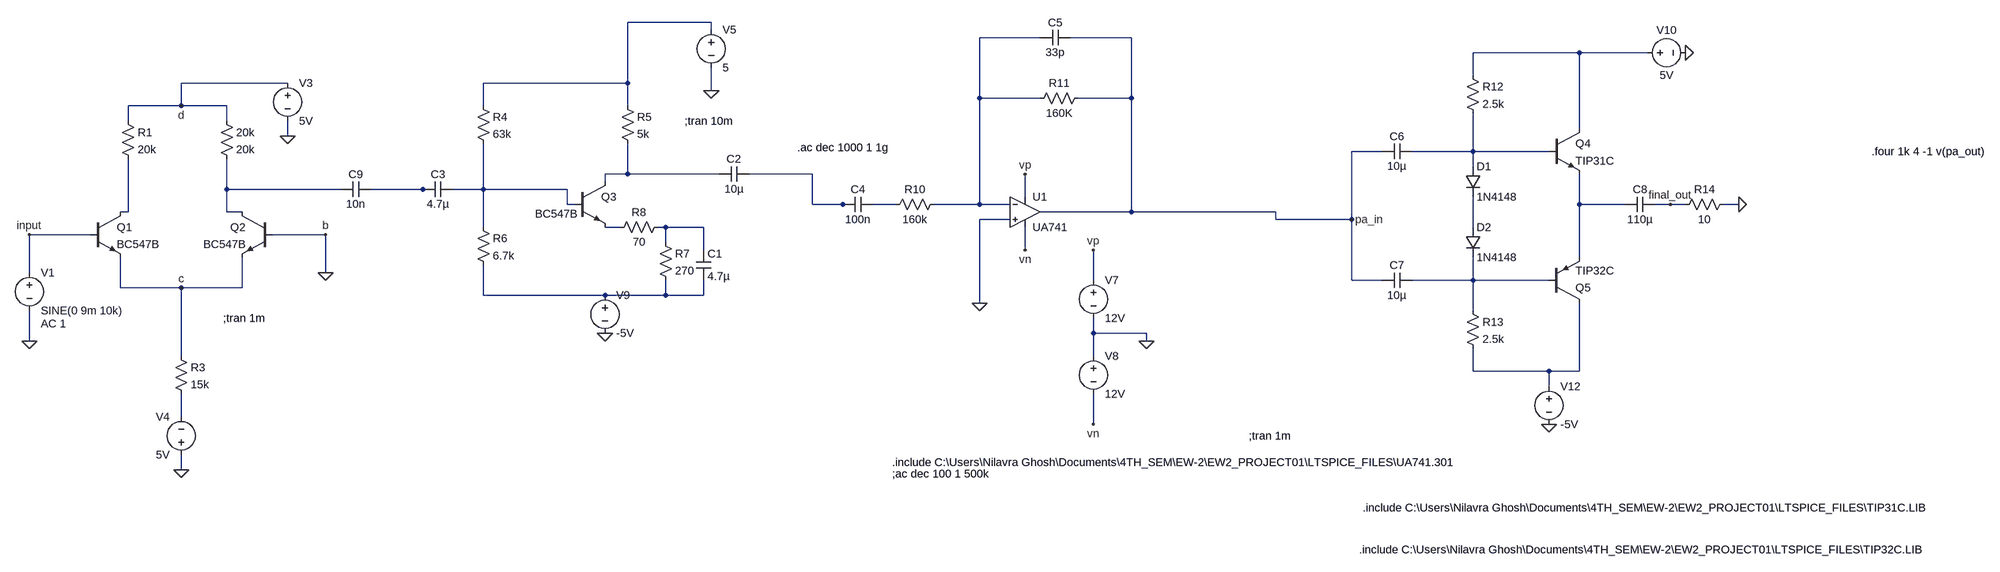
[diagram p0: schematic all_combined.asc]
all_combined.asc, the LTspice schematic file:
Version 4
SHEET 1 3748 680
WIRE 992 -624 816 -624
WIRE 992 -608 992 -624
WIRE 1712 -592 1584 -592
WIRE 1904 -592 1776 -592
WIRE 2848 -560 2624 -560
WIRE 2992 -560 2848 -560
WIRE 2624 -512 2624 -560
WIRE -16 -496 -240 -496
WIRE 816 -496 816 -624
WIRE 816 -496 512 -496
WIRE 992 -480 992 -528
WIRE 1584 -464 1584 -592
WIRE 1712 -464 1584 -464
WIRE 1904 -464 1904 -592
WIRE 1904 -464 1792 -464
WIRE -240 -448 -240 -496
WIRE -240 -448 -352 -448
WIRE -144 -448 -240 -448
WIRE 512 -448 512 -496
WIRE 816 -448 816 -496
WIRE -352 -416 -352 -448
WIRE -144 -416 -144 -448
WIRE 2848 -400 2848 -560
WIRE -16 -384 -16 -416
WIRE 2432 -352 2368 -352
WIRE 2624 -352 2624 -432
WIRE 2624 -352 2496 -352
WIRE 2784 -352 2624 -352
WIRE 2624 -320 2624 -352
WIRE 816 -304 816 -368
WIRE 816 -304 768 -304
WIRE 1008 -304 816 -304
WIRE 1232 -304 1072 -304
WIRE 768 -288 768 -304
WIRE -144 -272 -144 -336
WIRE 96 -272 -144 -272
WIRE 384 -272 160 -272
WIRE 400 -272 384 -272
WIRE 512 -272 512 -368
WIRE 512 -272 448 -272
WIRE 688 -272 512 -272
WIRE 1680 -256 1680 -304
WIRE 688 -240 688 -272
WIRE 704 -240 688 -240
WIRE 1232 -240 1232 -304
WIRE 1296 -240 1232 -240
WIRE 1312 -240 1296 -240
WIRE 1408 -240 1360 -240
WIRE 1584 -240 1584 -464
WIRE 1584 -240 1488 -240
WIRE 1648 -240 1584 -240
WIRE 2848 -240 2848 -304
WIRE 2944 -240 2848 -240
WIRE 3040 -240 3008 -240
WIRE 3072 -240 3040 -240
WIRE 3184 -240 3152 -240
WIRE -352 -224 -352 -336
WIRE -352 -224 -368 -224
WIRE -144 -224 -144 -272
WIRE -112 -224 -144 -224
WIRE 1904 -224 1904 -464
WIRE 1904 -224 1712 -224
WIRE 2208 -224 1904 -224
WIRE 1648 -208 1584 -208
WIRE 2208 -208 2208 -224
WIRE 2368 -208 2368 -352
WIRE 2368 -208 2208 -208
WIRE 512 -192 512 -272
WIRE 800 -192 768 -192
WIRE 896 -192 880 -192
WIRE 976 -192 896 -192
WIRE 2624 -192 2624 -256
WIRE -432 -176 -560 -176
WIRE 64 -176 -48 -176
WIRE 896 -160 896 -192
WIRE 976 -144 976 -192
WIRE 1680 -144 1680 -192
WIRE 2848 -128 2848 -240
WIRE -560 -96 -560 -176
WIRE 64 -96 64 -176
WIRE 1824 -80 1824 -144
WIRE 2368 -80 2368 -208
WIRE 2432 -80 2368 -80
WIRE 2624 -80 2624 -128
WIRE 2624 -80 2496 -80
WIRE 2784 -80 2624 -80
WIRE -368 -64 -368 -128
WIRE -240 -64 -368 -64
WIRE -112 -64 -112 -128
WIRE -112 -64 -240 -64
WIRE 512 -48 512 -112
WIRE 768 -48 512 -48
WIRE 896 -48 896 -80
WIRE 896 -48 768 -48
WIRE 976 -48 976 -80
WIRE 976 -48 896 -48
WIRE 1584 -32 1584 -208
WIRE 2624 -16 2624 -80
WIRE 1824 32 1824 0
WIRE 1936 32 1824 32
WIRE -560 48 -560 -16
WIRE 1936 48 1936 32
WIRE -240 80 -240 -64
WIRE 1824 80 1824 32
WIRE 2624 112 2624 64
WIRE 2784 112 2624 112
WIRE 2848 112 2848 -32
WIRE 2848 112 2784 112
WIRE 2784 144 2784 112
WIRE -240 208 -240 160
WIRE 1824 224 1824 160
WIRE -240 320 -240 288
FLAG -560 48 0
FLAG -16 -384 0
FLAG -240 320 0
FLAG -560 -176 input
FLAG 64 -176 b
FLAG -240 -64 c
FLAG -240 -448 d
FLAG 1936 48 0
FLAG 1824 -144 vp
FLAG 1824 224 vn
FLAG 1680 -304 vp
FLAG 1680 -144 vn
FLAG 1584 -32 0
FLAG 3184 -240 0
FLAG 3072 -560 0
FLAG 2784 224 0
FLAG 2368 -208 pa_in
FLAG 3040 -240 final_out
FLAG 992 -480 0
FLAG 768 32 0
FLAG 64 -96 0
SYMBOL voltage -560 -112 R0
WINDOW 123 24 124 Left 2
WINDOW 39 0 0 Left 0
SYMATTR Value2 AC 1
SYMATTR InstName V1
SYMATTR Value SINE(0 9m 10k)
SYMBOL res -368 -432 R0
SYMATTR InstName R1
SYMATTR Value 20k
SYMBOL res -160 -432 R0
SYMATTR InstName 20k
SYMATTR Value 20k
SYMBOL res -256 64 R0
SYMATTR InstName R3
SYMATTR Value 15k
SYMBOL npn -432 -224 R0
SYMATTR InstName Q1
SYMATTR Value BC547B
SYMBOL npn -48 -224 M0
SYMATTR InstName Q2
SYMATTR Value BC547B
SYMBOL voltage -16 -512 R0
WINDOW 123 0 0 Left 0
WINDOW 39 0 0 Left 0
SYMATTR InstName V3
SYMATTR Value 5V
SYMBOL voltage -240 304 R180
WINDOW 0 24 96 Left 2
WINDOW 3 24 16 Left 2
WINDOW 123 0 0 Left 0
WINDOW 39 0 0 Left 0
SYMATTR InstName V4
SYMATTR Value 5V
SYMBOL OpAmps\\opamp2 1680 -288 R0
SYMATTR InstName U1
SYMATTR Value UA741
SYMBOL voltage 1824 -96 R0
WINDOW 123 0 0 Left 0
WINDOW 39 0 0 Left 0
SYMATTR InstName V7
SYMATTR Value 12V
SYMBOL voltage 1824 64 R0
WINDOW 123 0 0 Left 0
WINDOW 39 0 0 Left 0
SYMATTR InstName V8
SYMATTR Value 12V
SYMBOL res 1504 -256 R90
WINDOW 0 0 56 VBottom 2
WINDOW 3 32 56 VTop 2
SYMATTR InstName R10
SYMATTR Value 160k
SYMBOL cap 1360 -256 R90
WINDOW 0 0 32 VBottom 2
WINDOW 3 32 32 VTop 2
SYMATTR InstName C4
SYMATTR Value 100n
SYMBOL res 1808 -480 R90
WINDOW 0 0 56 VBottom 2
WINDOW 3 32 56 VTop 2
SYMATTR InstName R11
SYMATTR Value 160K
SYMBOL cap 1776 -608 R90
WINDOW 0 0 32 VBottom 2
WINDOW 3 32 32 VTop 2
SYMATTR InstName C5
SYMATTR Value 33p
SYMBOL cap 2496 -368 R90
WINDOW 0 0 32 VBottom 2
WINDOW 3 32 32 VTop 2
SYMATTR InstName C6
SYMATTR Value 10µ
SYMBOL cap 2496 -96 R90
WINDOW 0 0 32 VBottom 2
WINDOW 3 32 32 VTop 2
SYMATTR InstName C7
SYMATTR Value 10µ
SYMBOL res 2608 -528 R0
SYMATTR InstName R12
SYMATTR Value 2.5k
SYMBOL res 2608 -32 R0
SYMATTR InstName R13
SYMATTR Value 2.5k
SYMBOL npn 2784 -400 R0
SYMATTR InstName Q4
SYMATTR Value TIP31C
SYMBOL pnp 2784 -32 M180
SYMATTR InstName Q5
SYMATTR Value TIP32C
SYMBOL diode 2608 -320 R0
SYMATTR InstName D1
SYMATTR Value 1N4148
SYMBOL diode 2608 -192 R0
SYMATTR InstName D2
SYMATTR Value 1N4148
SYMBOL voltage 2976 -560 R270
WINDOW 0 32 56 VTop 2
WINDOW 3 -32 56 VBottom 2
WINDOW 123 0 0 Left 0
WINDOW 39 0 0 Left 0
SYMATTR InstName V10
SYMATTR Value 5V
SYMBOL res 3168 -256 R90
WINDOW 0 0 56 VBottom 2
WINDOW 3 32 56 VTop 2
SYMATTR InstName R14
SYMATTR Value 10
SYMBOL voltage 2784 128 R0
WINDOW 123 0 0 Left 0
WINDOW 39 0 0 Left 0
SYMATTR InstName V12
SYMATTR Value -5V
SYMBOL cap 3008 -256 R90
WINDOW 0 0 32 VBottom 2
WINDOW 3 32 32 VTop 2
SYMATTR InstName C8
SYMATTR Value 110µ
SYMBOL res 496 -464 R0
SYMATTR InstName R4
SYMATTR Value 63k
SYMBOL res 800 -464 R0
SYMATTR InstName R5
SYMATTR Value 5k
SYMBOL cap 960 -144 R0
SYMATTR InstName C1
SYMATTR Value 4.7µ
SYMBOL res 496 -208 R0
SYMATTR InstName R6
SYMATTR Value 6.7k
SYMBOL npn 704 -288 R0
WINDOW 3 -83 68 Left 2
SYMATTR Value BC547B
SYMATTR InstName Q3
SYMBOL res 880 -176 R0
SYMATTR InstName R7
SYMATTR Value 270
SYMBOL res 896 -208 R90
WINDOW 0 0 56 VBottom 2
WINDOW 3 32 56 VTop 2
SYMATTR InstName R8
SYMATTR Value 70
SYMBOL voltage 992 -624 R0
WINDOW 123 0 0 Left 0
WINDOW 39 0 0 Left 0
SYMATTR InstName V5
SYMATTR Value 5
SYMBOL cap 1072 -320 R90
WINDOW 0 0 32 VBottom 2
WINDOW 3 32 32 VTop 2
SYMATTR InstName C2
SYMATTR Value 10µ
SYMBOL cap 448 -288 R90
WINDOW 0 0 32 VBottom 2
WINDOW 3 32 32 VTop 2
SYMATTR InstName C3
SYMATTR Value 4.7µ
SYMBOL voltage 768 -64 R0
WINDOW 123 0 0 Left 0
WINDOW 39 0 0 Left 0
SYMATTR InstName V9
SYMATTR Value -5V
SYMBOL cap 160 -288 R90
WINDOW 0 0 32 VBottom 2
WINDOW 3 32 32 VTop 2
SYMATTR InstName C9
SYMATTR Value 10n
TEXT -152 0 Left 2 !;tran 1m
TEXT 1400 304 Left 2 !.include C:\\Users\\Nilavra Ghosh\\Documents\\4TH_SEM\\EW-2\\EW2_PROJECT01\\LTSPICE_FILES\\UA741.301
TEXT 1400 328 Left 2 !;ac dec 100 1 500k
TEXT 2152 248 Left 2 !;tran 1m
TEXT 936 -416 Left 2 !;tran 10m
TEXT 1200 -360 Left 2 !.ac dec 1000 1 1g
TEXT 3464 -352 Left 2 !.four 1k 4 -1 v(pa_out)
TEXT 2392 400 Left 2 !.include C:\\Users\\Nilavra Ghosh\\Documents\\4TH_SEM\\EW-2\\EW2_PROJECT01\\LTSPICE_FILES\\TIP31C.LIB
TEXT 2384 488 Left 2 !.include C:\\Users\\Nilavra Ghosh\\Documents\\4TH_SEM\\EW-2\\EW2_PROJECT01\\LTSPICE_FILES\\TIP32C.LIB

The netlist it stands for:
* all_combined.asc
V1 input 0 SINE(0 9m 10k) AC 1
R1 d N012 20k
R§20k d N007 20k
R3 c N019 15k
Q1 N012 input c 0 BC547B
Q2 N007 0 c 0 BC547B
V3 d 0 5V
V4 0 N019 5V
XU1 0 N002 vp vn pa_in UA741  ; pins In+ In- V+ V- OUT
V7 vp 0 12V
V8 0 vn 12V
R10 N002 N010 160k
C4 N010 N006 100n
R11 pa_in N002 160K
C5 pa_in N002 33p
C6 N004 pa_in 10µ
C7 N016 pa_in 10µ
R12 N003 N004 2.5k
R13 N016 N018 2.5k
Q4 N003 N004 N011 0 TIP31C
Q5 N018 N016 N011 0 TIP32C
D1 N004 N015 1N4148
D2 N015 N016 1N4148
V10 N003 0 5V
R14 0 final_out 10
V12 N018 0 -5V
C8 final_out N011 110µ
R4 N001 N009 63k
R5 N001 N005 5k
C1 N014 N017 4.7µ
R6 N009 N017 6.7k
Q3 N005 N009 N013 0 BC547B
R7 N014 N017 270
R8 N014 N013 70
V5 N001 0 5
C2 N006 N005 10µ
C3 N009 N008 4.7µ
V9 N017 0 -5V
C9 N008 N007 10n
.model D D
.lib standard.dio
.model NPN NPN
.model PNP PNP
.lib standard.bjt
;tran 1m
.include C:\Users\Nilavra Ghosh\Documents\4TH_SEM\EW-2\EW2_PROJECT01\LTSPICE_FILES\UA741.301
;ac dec 100 1 500k
;tran 1m
;tran 10m
.ac dec 1000 1 1g
.four 1k 4 -1 v(pa_out)
.include C:\Users\Nilavra Ghosh\Documents\4TH_SEM\EW-2\EW2_PROJECT01\LTSPICE_FILES\TIP31C.LIB
.include C:\Users\Nilavra Ghosh\Documents\4TH_SEM\EW-2\EW2_PROJECT01\LTSPICE_FILES\TIP32C.LIB
.backanno
.end